# Altium schematic sheet INV.CTL.V1.SchDoc
size 1150 x 699 mm; SheetNumber: 1; SheetTotal: 1
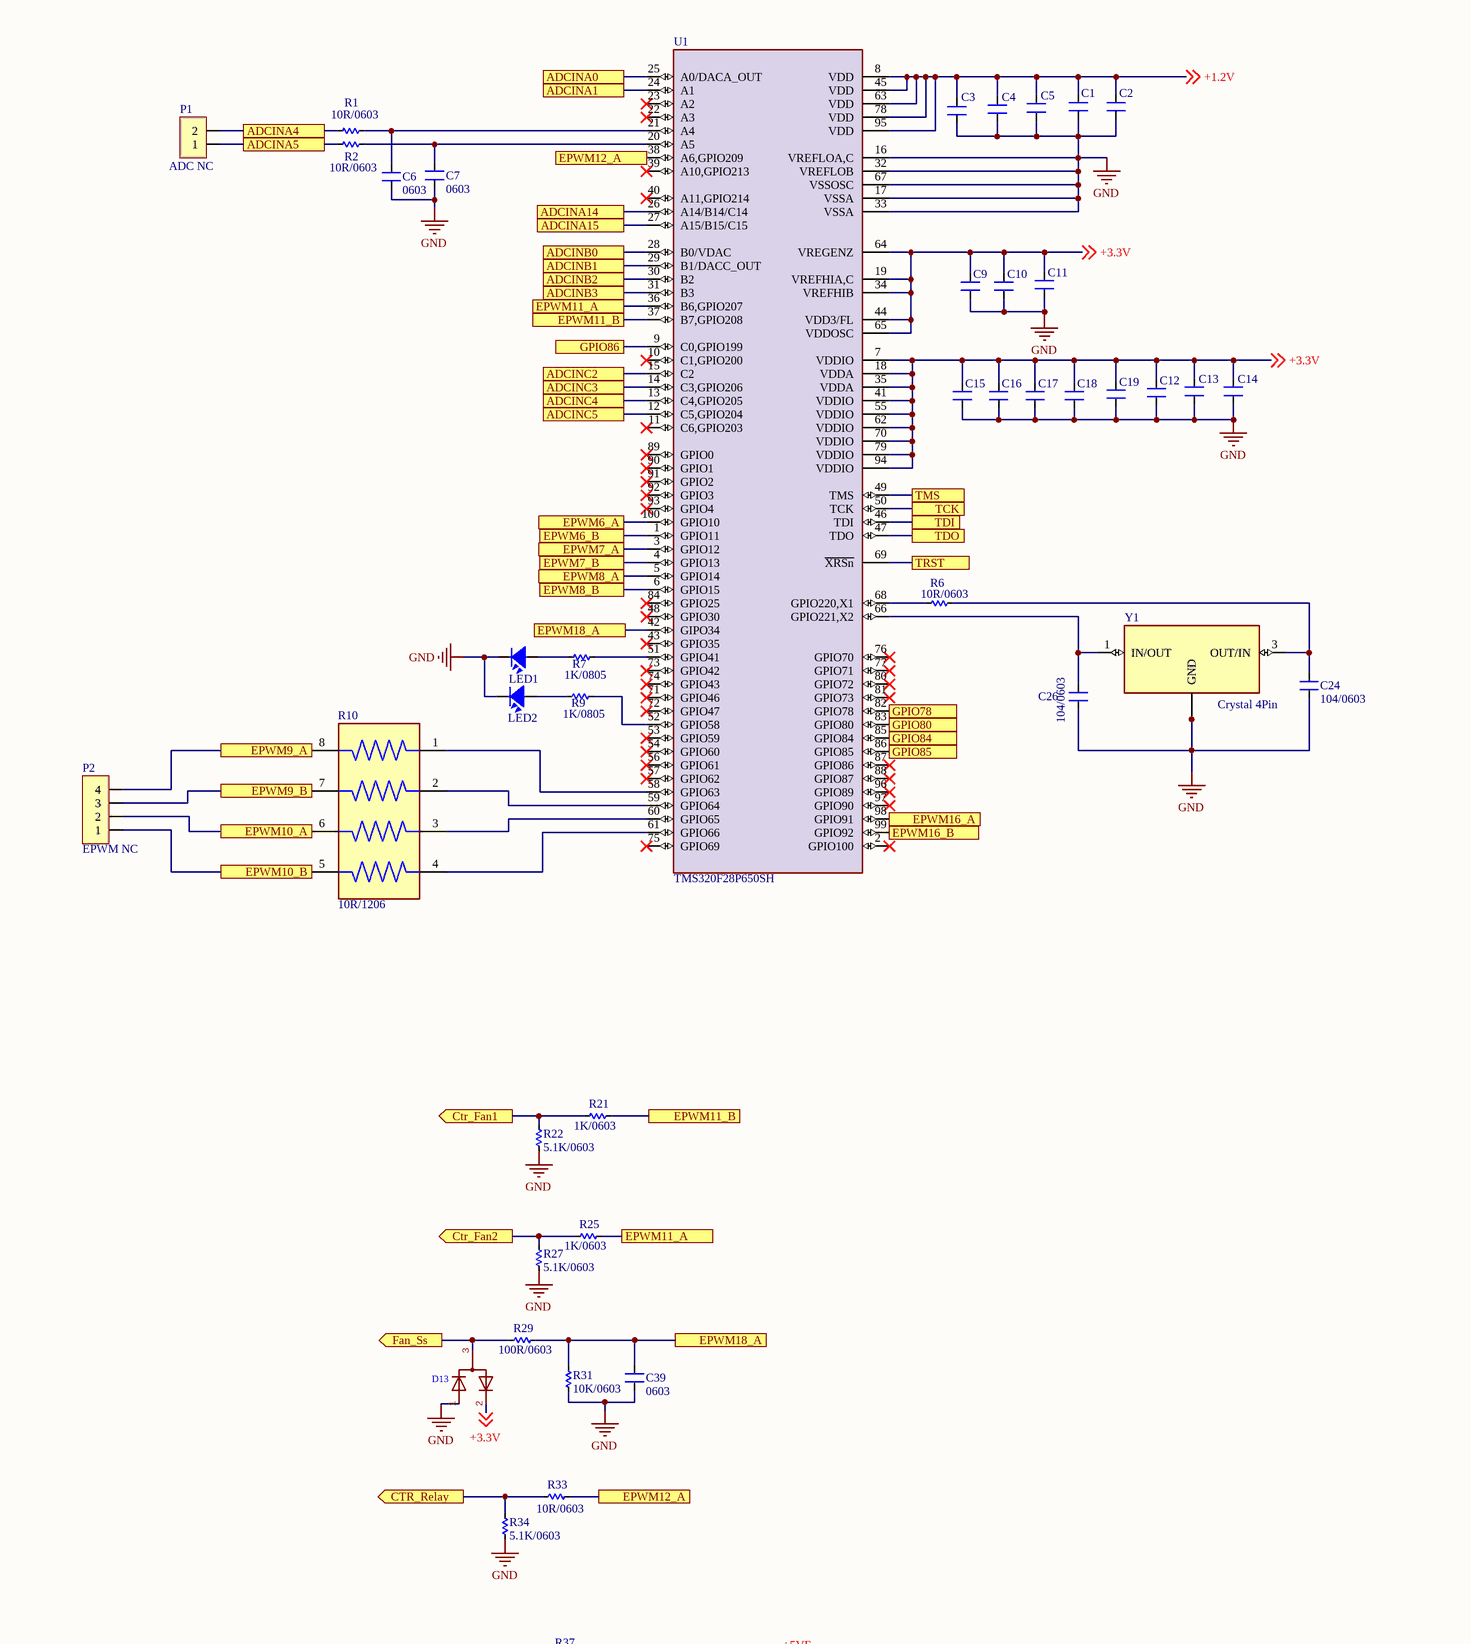
[diagram p0: INV.CTL.V1.SchDoc, top left]
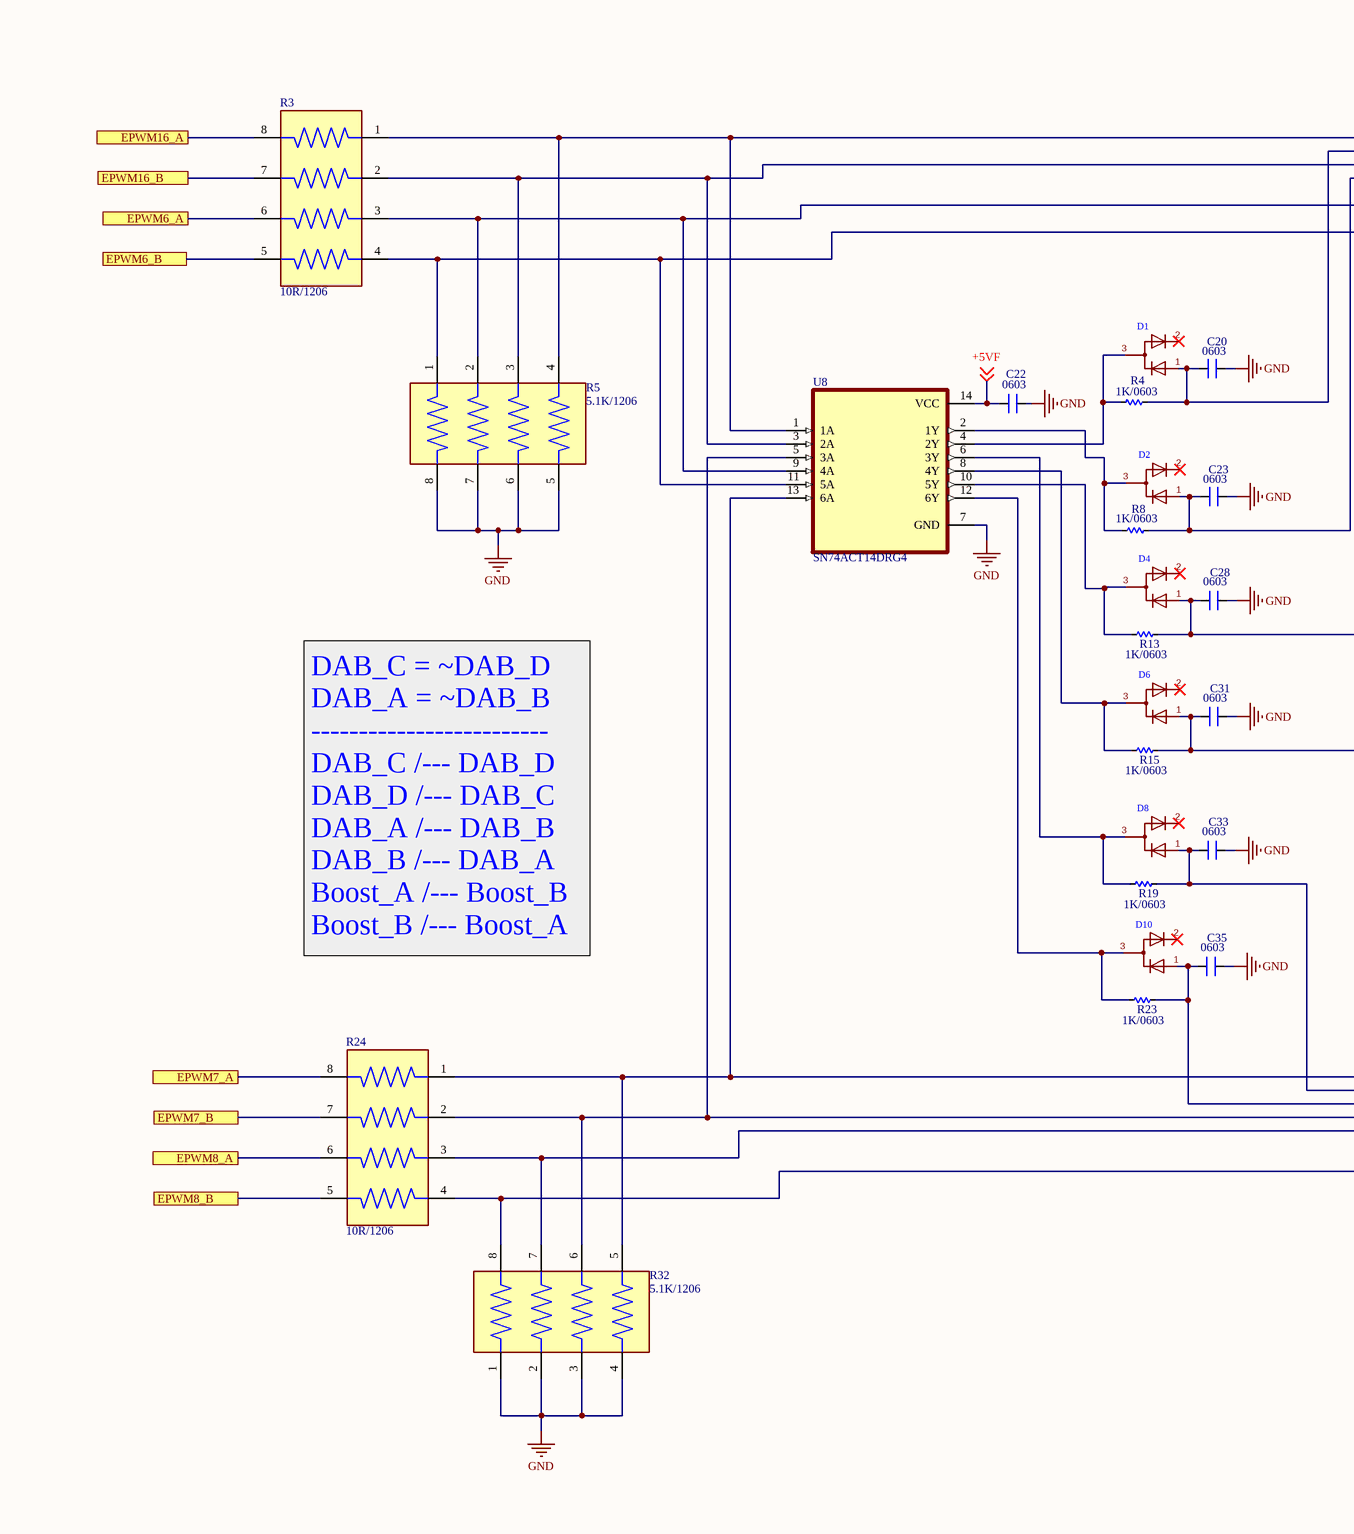
[diagram p1: INV.CTL.V1.SchDoc, top middle]
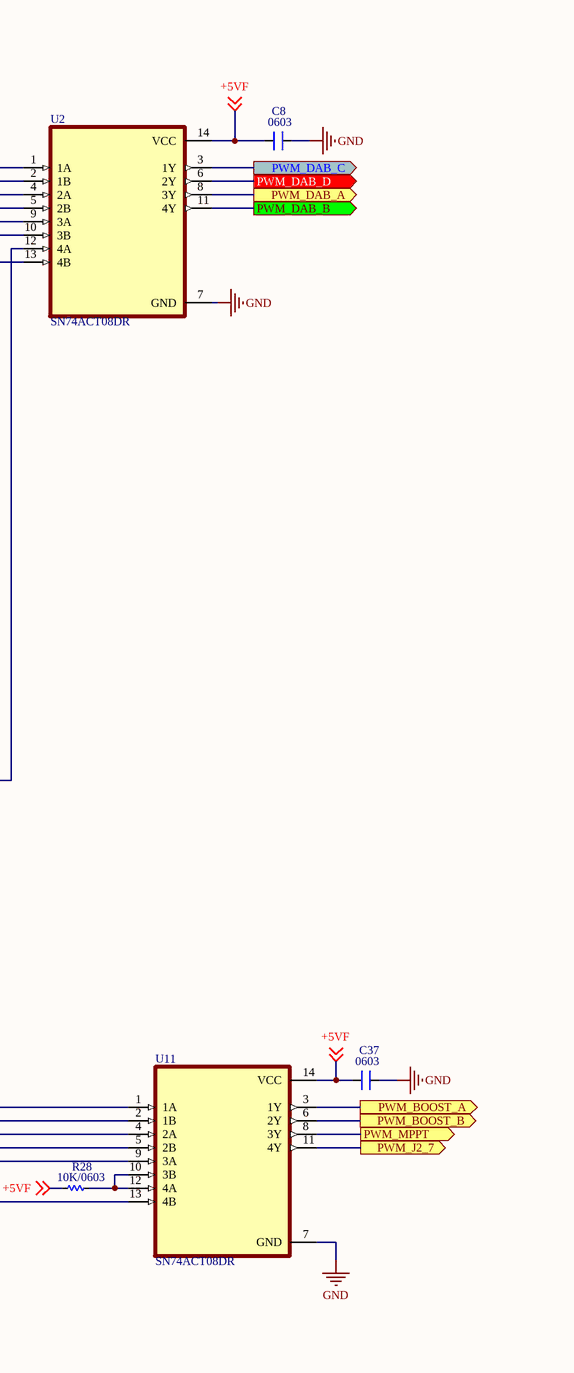
[diagram p2: INV.CTL.V1.SchDoc, top right]
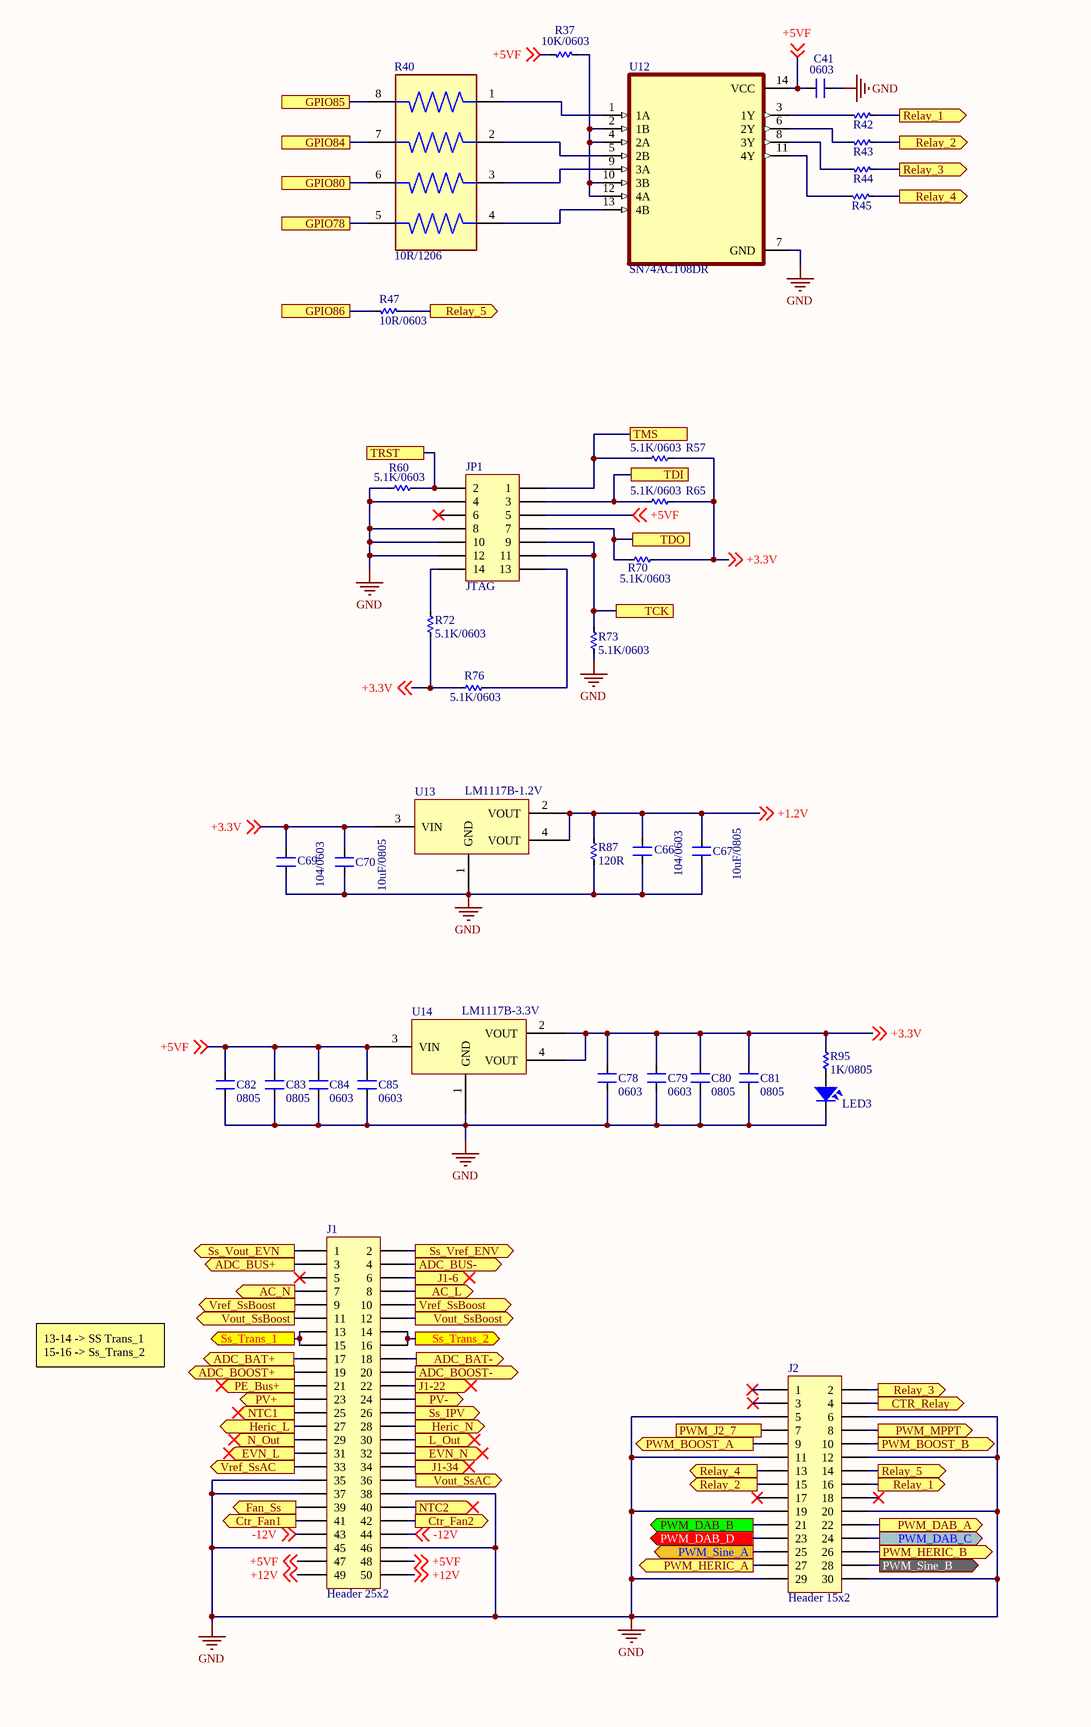
[diagram p3: INV.CTL.V1.SchDoc, bottom left]
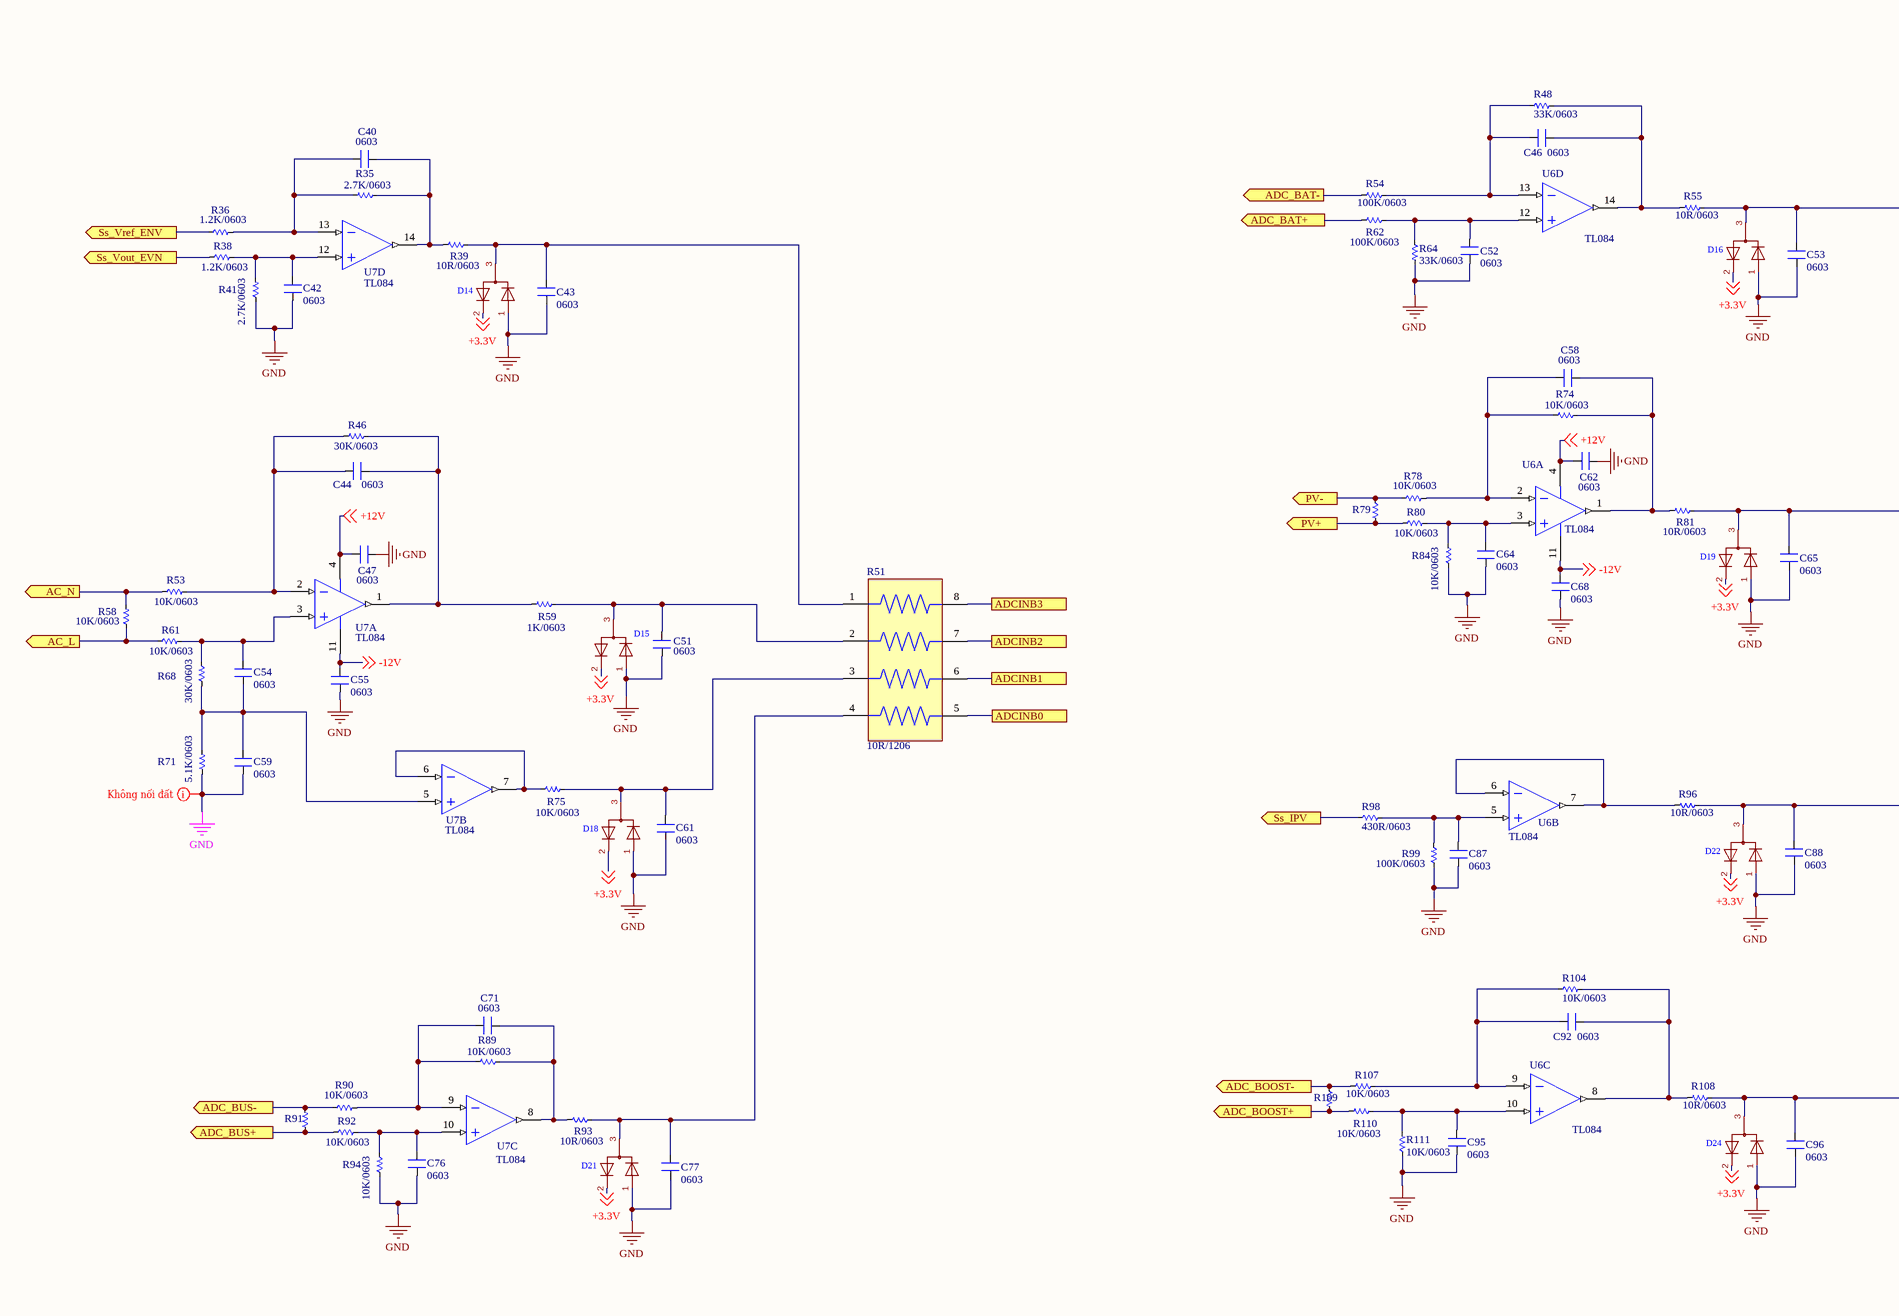
[diagram p4: INV.CTL.V1.SchDoc, bottom middle]
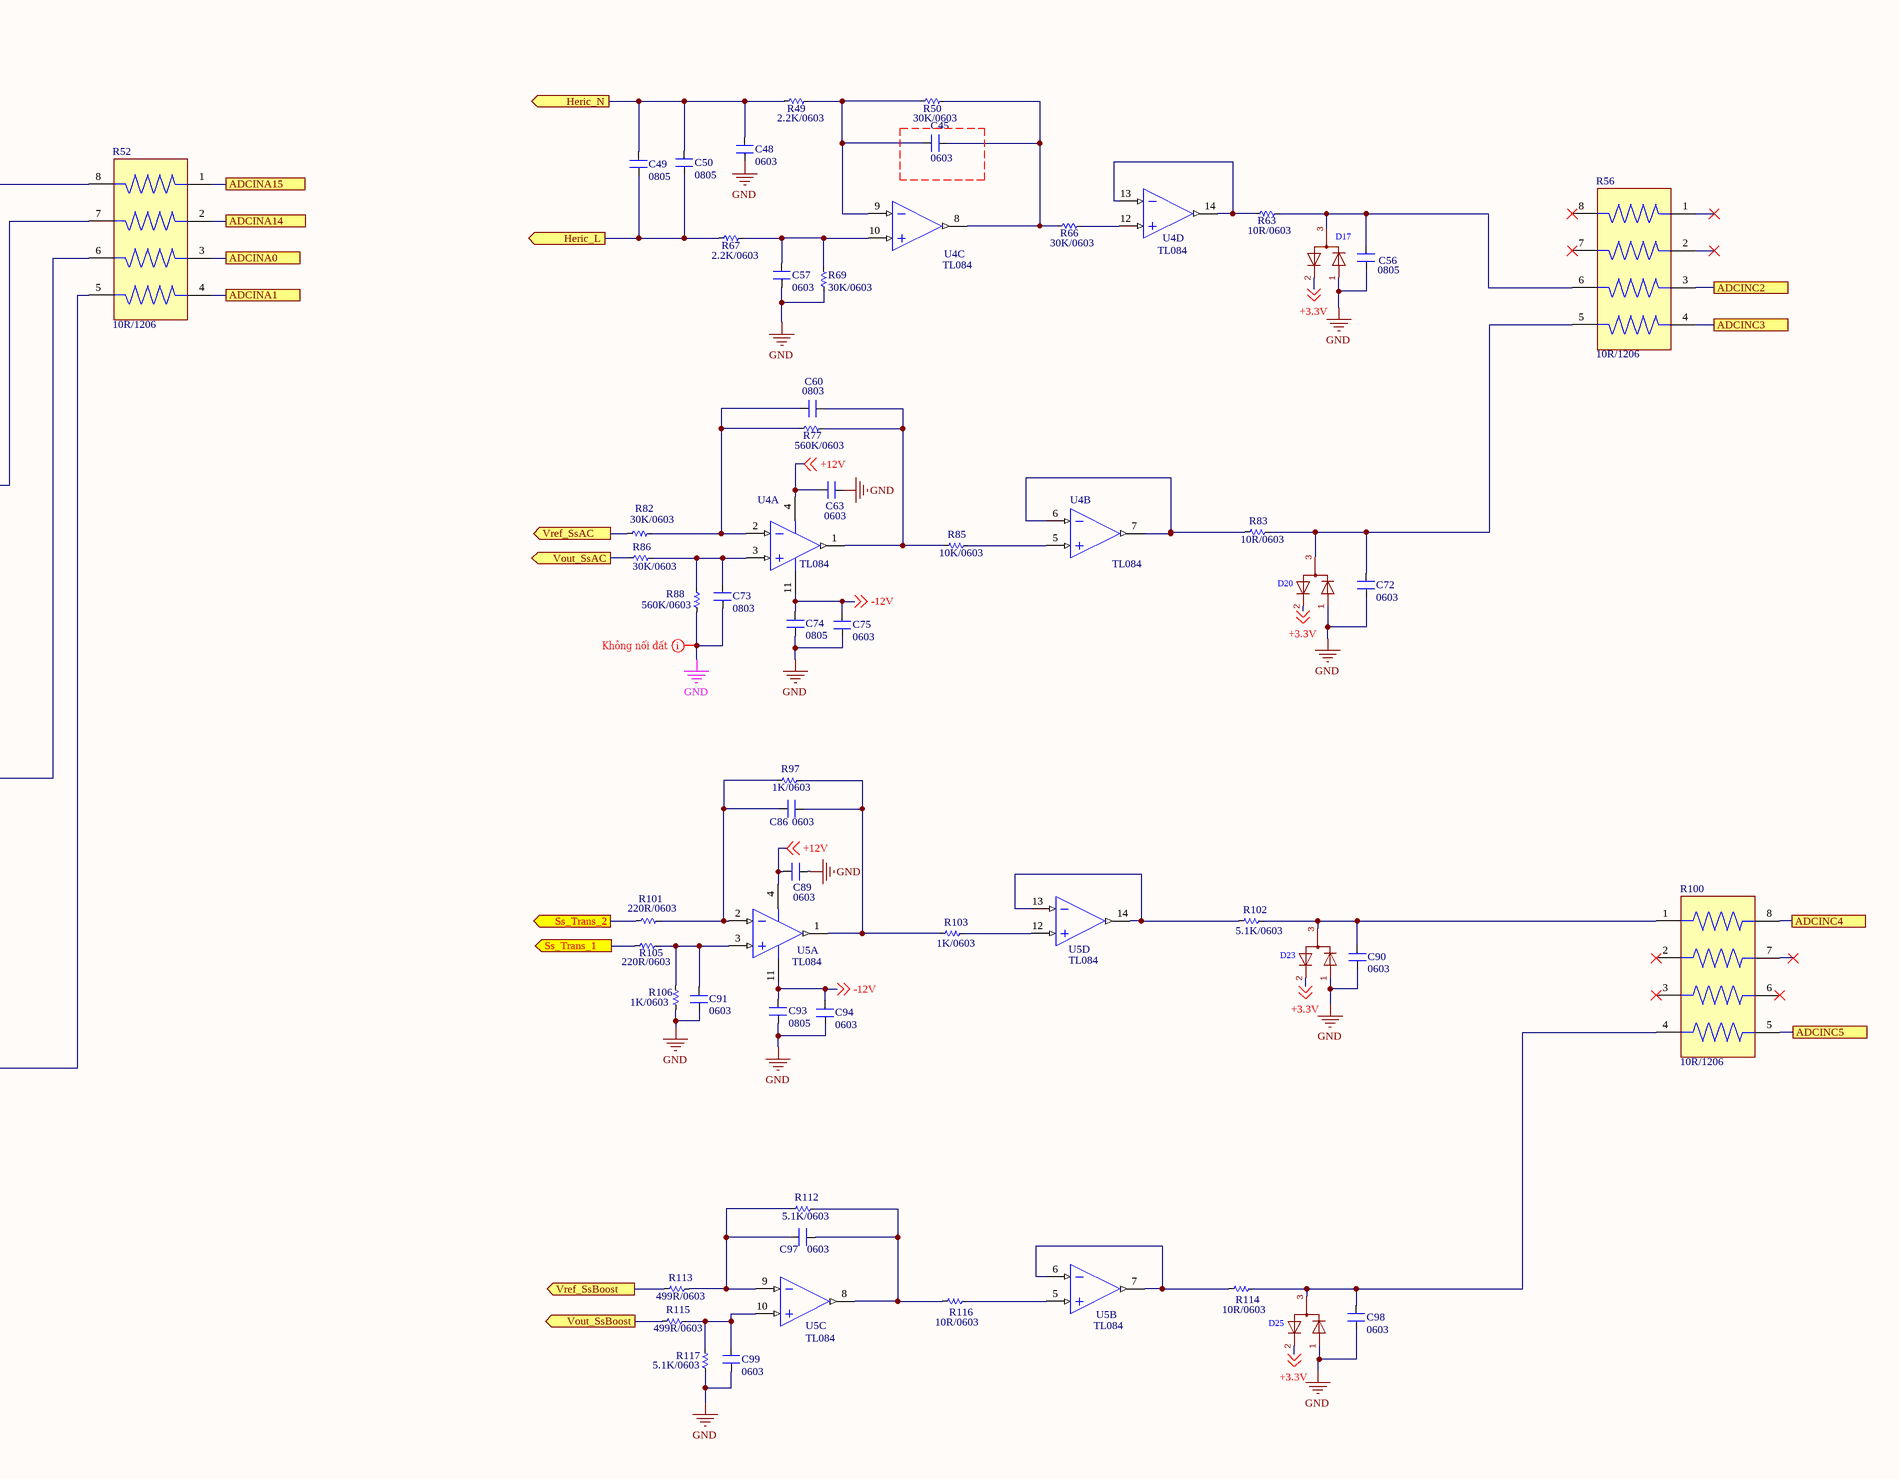
[diagram p5: INV.CTL.V1.SchDoc, bottom right]

## Parts
C1  104/0603  [CAP-SMD-0603]  (value not drawn)
C2  104/0603  [CAP-SMD-0603]  (value not drawn)
C3  104/0603  [CAP-SMD-0603]  (value not drawn)
C4  104/0603  [CAP-SMD-0603]  (value not drawn)
C5  104/0603  [CAP-SMD-0603]  (value not drawn)
C6  0603  [CAP-SMD-0603]
C7  0603  [CAP-SMD-0603]
C8  0603  [CAP-SMD-0603]
C9  104/0603  [CAP-SMD-0603]  (value not drawn)
C10  104/0603  [CAP-SMD-0603]  (value not drawn)
C11  104/0603  [CAP-SMD-0603]  (value not drawn)
C12  104/0603  [CAP-SMD-0603]  (value not drawn)
C13  104/0603  [CAP-SMD-0603]  (value not drawn)
C14  104/0603  [CAP-SMD-0603]  (value not drawn)
C15  104/0603  [CAP-SMD-0603]  (value not drawn)
C16  104/0603  [CAP-SMD-0603]  (value not drawn)
C17  104/0603  [CAP-SMD-0603]  (value not drawn)
C18  104/0603  [CAP-SMD-0603]  (value not drawn)
C19  104/0603  [CAP-SMD-0603]  (value not drawn)
C20  0603  [CAP-SMD-0603]
C22  0603  [CAP-SMD-0603]
C23  0603  [CAP-SMD-0603]
C24  104/0603  [CAP-SMD-0603]
C26  104/0603  [CAP-SMD-0603]
C28  0603  [CAP-SMD-0603]
C31  0603  [CAP-SMD-0603]
C33  0603  [CAP-SMD-0603]
C35  0603  [CAP-SMD-0603]
C37  0603  [CAP-SMD-0603]
C39  0603  [CAP-SMD-0603]
C40  0603  [CAP-SMD-0603]
C41  0603  [CAP-SMD-0603]
C42  0603  [CAP-SMD-0603]
C43  0603  [CAP-SMD-0603]
C44  0603  [CAP-SMD-0603]
C45  0603  [CAP-SMD-0603]
C46  0603  [CAP-SMD-0603]
C47  0603  [CAP-SMD-0603]
C48  0603  [CAP-SMD-0603]
C49  0805  [CAP-SMD-0805 EX]
C50  0805  [CAP-SMD-0805 EX]
C51  0603  [CAP-SMD-0603]
C52  0603  [CAP-SMD-0603]
C53  0603  [CAP-SMD-0603]
C54  0603  [CAP-SMD-0603]
C55  0603  [CAP-SMD-0603]
C56  0805  [CAP-SMD-0603]
C57  0603  [CAP-SMD-0603]
C58  0603  [CAP-SMD-0603]
C59  0603  [CAP-SMD-0603]
C60  0803  [CAP-SMD-0603]
C61  0603  [CAP-SMD-0603]
C62  0603  [CAP-SMD-0603]
C63  0603  [CAP-SMD-0603]
C64  0603  [CAP-SMD-0603]
C65  0603  [CAP-SMD-0603]
C66  104/0603  [CAP-SMD-0603]
C67  10uF/0805  [CAP-SMD-0805 EX]
C68  0603  [CAP-SMD-0603]
C69  104/0603  [CAP-SMD-0603]
C70  10uF/0805  [CAP-SMD-0805 EX]
C71  0603  [CAP-SMD-0603]
C72  0603  [CAP-SMD-0603]
C73  0803  [CAP-SMD-0603]
C74  0805  [CAP-SMD-0805 EX]
C75  0603  [CAP-SMD-0603]
C76  0603  [CAP-SMD-0603]
C77  0603  [CAP-SMD-0603]
C78  0603  [CAP-SMD-0603]
C79  0603  [CAP-SMD-0603]
C80  0805  [CAP-SMD-0805 EX]
C81  0805  [CAP-SMD-0805 EX]
C82  0805  [CAP-SMD-0805 EX]
C83  0805  [CAP-SMD-0805 EX]
C84  0603  [CAP-SMD-0603]
C85  0603  [CAP-SMD-0603]
C86  0603  [CAP-SMD-0603]
C87  0603  [CAP-SMD-0603]
C88  0603  [CAP-SMD-0603]
C89  0603  [CAP-SMD-0603]
C90  0603  [CAP-SMD-0603]
C91  0603  [CAP-SMD-0603]
C92  0603  [CAP-SMD-0603]
C93  0805  [CAP-SMD-0805 EX]
C94  0603  [CAP-SMD-0603]
C95  0603  [CAP-SMD-0603]
C96  0603  [CAP-SMD-0603]
C97  0603  [CAP-SMD-0603]
C98  0603  [CAP-SMD-0603]
C99  0603  [CAP-SMD-0603]
D1  Dual-Diode_CA_1  [SOT23-132]  (value not drawn)
D2  Dual-Diode_CA_1  [SOT23-132]  (value not drawn)
D4  Dual-Diode_CA_1  [SOT23-132]  (value not drawn)
D6  Dual-Diode_CA_1  [SOT23-132]  (value not drawn)
D8  Dual-Diode_CA_1  [SOT23-132]  (value not drawn)
D10  Dual-Diode_CA_1  [SOT23-132]  (value not drawn)
D13  Dual-Diode_CA_1  [SOT23-132]  (value not drawn)
D14  Dual-Diode_CA_1  [SOT23-132]  (value not drawn)
D15  Dual-Diode_CA_1  [SOT23-132]  (value not drawn)
D16  Dual-Diode_CA_1  [SOT23-132]  (value not drawn)
D17  Dual-Diode_CA_1  [SOT23-132]  (value not drawn)
D18  Dual-Diode_CA_1  [SOT23-132]  (value not drawn)
D19  Dual-Diode_CA_1  [SOT23-132]  (value not drawn)
D20  Dual-Diode_CA_1  [SOT23-132]  (value not drawn)
D21  Dual-Diode_CA_1  [SOT23-132]  (value not drawn)
D22  Dual-Diode_CA_1  [SOT23-132]  (value not drawn)
D23  Dual-Diode_CA_1  [SOT23-132]  (value not drawn)
D24  Dual-Diode_CA_1  [SOT23-132]  (value not drawn)
D25  Dual-Diode_CA_1  [SOT23-132]  (value not drawn)
J1  Header 25x2  [Header 2x50 V2]
J2  Header 15x2  [Header 2x15 V2]
JP1  JTAG  [Header 2x7]
LED1  LED  [LED-0805-Red]  (value not drawn)
LED2  LED  [LED-0805-Red]  (value not drawn)
LED3  LED  [LED-0805-Red]  (value not drawn)
P1  ADC NC  [JP2-C1T]
P2  EPWM NC  [JP4-C1T]
R1  10R/0603  [RES-SMD-0603]
R2  10R/0603  [RES-SMD-0603]
R3  10R/1206  [RESCAXS80P320X150X55-8N]
R4  1K/0603  [RES-SMD-0603]
R5  5.1K/1206  [RESCAXS80P320X150X55-8N]
R6  10R/0603  [RES-SMD-0603]
R7  1K/0805  [RES-SMD-0603]
R8  1K/0603  [RES-SMD-0603]
R9  1K/0805  [RES-SMD-0603]
R10  10R/1206  [RESCAXS80P320X150X55-8N]
R13  1K/0603  [RES-SMD-0603]
R15  1K/0603  [RES-SMD-0603]
R19  1K/0603  [RES-SMD-0603]
R21  1K/0603  [RES-SMD-0603]
R22  5.1K/0603  [RES-SMD-0603]
R23  1K/0603  [RES-SMD-0603]
R24  10R/1206  [RESCAXS80P320X150X55-8N]
R25  1K/0603  [RES-SMD-0603]
R27  5.1K/0603  [RES-SMD-0603]
R28  10K/0603  [RES-SMD-0603]
R29  100R/0603  [RES-SMD-0603]
R31  10K/0603  [RES-SMD-0603]
R32  5.1K/1206  [RESCAXS80P320X150X55-8N]
R33  10R/0603  [RES-SMD-0603]
R34  5.1K/0603  [RES-SMD-0603]
R35  2.7K/0603  [RES-SMD-0603]
R36  1.2K/0603  [RES-SMD-0603]
R37  10K/0603  [RES-SMD-0603]
R38  1.2K/0603  [RES-SMD-0603]
R39  10R/0603  [RES-SMD-0603]
R40  10R/1206  [RESCAXS80P320X150X55-8N]
R41  2.7K/0603  [RES-SMD-0603]
R42  10R/0603  [RES-SMD-0603]  (value not drawn)
R43  10R/0603  [RES-SMD-0603]  (value not drawn)
R44  10R/0603  [RES-SMD-0603]  (value not drawn)
R45  10R/0603  [RES-SMD-0603]  (value not drawn)
R46  30K/0603  [RES-SMD-0603]
R47  10R/0603  [RES-SMD-0603]
R48  33K/0603  [RES-SMD-0603]
R49  2.2K/0603  [RES-SMD-0603]
R50  30K/0603  [RES-SMD-0603]
R51  10R/1206  [RESCAXS80P320X150X55-8N]
R52  10R/1206  [RESCAXS80P320X150X55-8N]
R53  10K/0603  [RES-SMD-0603]
R54  100K/0603  [RES-SMD-0603]
R55  10R/0603  [RES-SMD-0603]
R56  10R/1206  [RESCAXS80P320X150X55-8N]
R57  5.1K/0603  [RES-SMD-0603]
R58  10K/0603  [RES-SMD-0603]
R59  1K/0603  [RES-SMD-0603]
R60  5.1K/0603  [RES-SMD-0603]
R61  10K/0603  [RES-SMD-0603]
R62  100K/0603  [RES-SMD-0603]
R63  10R/0603  [RES-SMD-0603]
R64  33K/0603  [RES-SMD-0603]
R65  5.1K/0603  [RES-SMD-0603]
R66  30K/0603  [RES-SMD-0603]
R67  2.2K/0603  [RES-SMD-0603]
R68  30K/0603  [RES-SMD-0603]
R69  30K/0603  [RES-SMD-0603]
R70  5.1K/0603  [RES-SMD-0603]
R71  5.1K/0603  [RES-SMD-0603]
R72  5.1K/0603  [RES-SMD-0603]
R73  5.1K/0603  [RES-SMD-0603]
R74  10K/0603  [RES-SMD-0603]
R75  10K/0603  [RES-SMD-0603]
R76  5.1K/0603  [RES-SMD-0603]
R77  560K/0603  [RES-SMD-0603]
R78  10K/0603  [RES-SMD-0603]
R79  10K/0603  [RES-SMD-0603]  (value not drawn)
R80  10K/0603  [RES-SMD-0603]
R81  10R/0603  [RES-SMD-0603]
R82  30K/0603  [RES-SMD-0603]
R83  10R/0603  [RES-SMD-0603]
R84  10K/0603  [RES-SMD-0603]
R85  10K/0603  [RES-SMD-0603]
R86  30K/0603  [RES-SMD-0603]
R87  120R  [RES-SMD-0603]
R88  560K/0603  [RES-SMD-0603]
R89  10K/0603  [RES-SMD-0603]
R90  10K/0603  [RES-SMD-0603]
R91  10K/0603  [RES-SMD-0603]  (value not drawn)
R92  10K/0603  [RES-SMD-0603]
R93  10R/0603  [RES-SMD-0603]
R94  10K/0603  [RES-SMD-0603]
R95  1K/0805  [RES-SMD-0805 EX]
R96  10R/0603  [RES-SMD-0603]
R97  1K/0603  [RES-SMD-0603]
R98  430R/0603  [RES-SMD-0603]
R99  100K/0603  [RES-SMD-0603]
R100  10R/1206  [RESCAXS80P320X150X55-8N]
R101  220R/0603  [RES-SMD-0603]
R102  5.1K/0603  [RES-SMD-0603]
R103  1K/0603  [RES-SMD-0603]
R104  10K/0603  [RES-SMD-0603]
R105  220R/0603  [RES-SMD-0603]
R106  1K/0603  [RES-SMD-0603]
R107  10K/0603  [RES-SMD-0603]
R108  10R/0603  [RES-SMD-0603]
R109  10K/0603  [RES-SMD-0603]  (value not drawn)
R110  10K/0603  [RES-SMD-0603]
R111  10K/0603  [RES-SMD-0603]
R112  5.1K/0603  [RES-SMD-0603]
R113  499R/0603  [RES-SMD-0603]
R114  10R/0603  [RES-SMD-0603]
R115  499R/0603  [RES-SMD-0603]
R116  10R/0603  [RES-SMD-0603]
R117  5.1K/0603  [RES-SMD-0603]
U1  TMS320F28P650SH  [HTQFP-100]
U2  SN74ACT08DR  [SOIC127P600X175-14N]
U4  TL084  [SO14]  (parts A,B,C,D of 4)
U5  TL084  [SO14]  (parts A,B,C,D of 4)
U6  TL084  [SO14]  (parts A,B,C,D of 4)
U7  TL084  [SO14]  (parts A,B,C,D of 4)
U8  SN74ACT14DRG4  [SOIC127P600X175-14N]
U11  SN74ACT08DR  [SOIC127P600X175-14N]
U12  SN74ACT08DR  [SOIC127P600X175-14N]
U13  LM1117B-1.2V  [SOT223]
U14  LM1117B-3.3V  [SOT223]
Y1  Crystal 4Pin  [XTAL_5032]

## Ports
AC_L (out, see INV.CTL.V1[1D]), AC_L (out, see INV.CTL.V1[2C]), AC_N (out, see INV.CTL.V1[1D]), AC_N (out, see INV.CTL.V1[2C]), ADC_BAT+ (out, see INV.CTL.V1[1D]), ADC_BAT+ (out, see INV.CTL.V1[3C]), ADC_BAT- (out, see INV.CTL.V1[1D]), ADC_BAT- (out, see INV.CTL.V1[3C]), ADC_BOOST+ (out, see INV.CTL.V1[1D]), ADC_BOOST+ (out, see INV.CTL.V1[3D]), ADC_BOOST- (out, see INV.CTL.V1[1D]), ADC_BOOST- (out, see INV.CTL.V1[3D]), ADC_BUS+ (out, see INV.CTL.V1[1D]), ADC_BUS+ (out, see INV.CTL.V1[2D]), ADC_BUS- (out, see INV.CTL.V1[1D]), ADC_BUS- (out, see INV.CTL.V1[2D]), ADCINA0 (see INV.CTL.V1[1A]), ADCINA0 (see INV.CTL.V1[4C]), ADCINA1 (see INV.CTL.V1[1A]), ADCINA1 (see INV.CTL.V1[4C]), ADCINA4, ADCINA5, ADCINA14 (see INV.CTL.V1[1A]), ADCINA14 (see INV.CTL.V1[4C]), ADCINA15 (see INV.CTL.V1[1A]), ADCINA15 (see INV.CTL.V1[4C]), ADCINB0 (see INV.CTL.V1[1A]), ADCINB0 (see INV.CTL.V1[3C]), ADCINB1 (see INV.CTL.V1[1A]), ADCINB1 (see INV.CTL.V1[3C]), ADCINB2 (see INV.CTL.V1[1A]), ADCINB2 (see INV.CTL.V1[3C]), ADCINB3 (see INV.CTL.V1[1A]), ADCINB3 (see INV.CTL.V1[3C]), ADCINC2 (see INV.CTL.V1[1A]), ADCINC2 (see INV.CTL.V1[6C]), ADCINC3 (see INV.CTL.V1[1A]), ADCINC3 (see INV.CTL.V1[6C]), ADCINC4 (see INV.CTL.V1[1A]), ADCINC4 (see INV.CTL.V1[6D]), ADCINC5 (see INV.CTL.V1[1A]), ADCINC5 (see INV.CTL.V1[6D]), Ctr_Fan1 (out, see INV.CTL.V1[1B]), Ctr_Fan1 (out, see INV.CTL.V1[1D]), Ctr_Fan2 (out, see INV.CTL.V1[1B]), Ctr_Fan2 (out, see INV.CTL.V1[1D]), CTR_Relay (out, see INV.CTL.V1[1B]), CTR_Relay (out, see INV.CTL.V1[1D]), EPWM6_A (see INV.CTL.V1[1A]), EPWM6_A (see INV.CTL.V1[4A]), EPWM6_B (see INV.CTL.V1[1A]), EPWM6_B (see INV.CTL.V1[4A]), EPWM7_A (see INV.CTL.V1[1A]), EPWM7_A (see INV.CTL.V1[5B]), EPWM7_B (see INV.CTL.V1[1A]), EPWM7_B (see INV.CTL.V1[5B]), EPWM8_A (see INV.CTL.V1[1A]), EPWM8_A (see INV.CTL.V1[5B]), EPWM8_B (see INV.CTL.V1[1A]), EPWM8_B (see INV.CTL.V1[5B]), EPWM9_A, EPWM9_B, EPWM10_A, EPWM10_B, EPWM11_A (see INV.CTL.V1[1A]), EPWM11_A (see INV.CTL.V1[1B]), EPWM11_B (see INV.CTL.V1[1A]), EPWM11_B (see INV.CTL.V1[1B]), EPWM12_A (see INV.CTL.V1[1A]), EPWM12_A (see INV.CTL.V1[1B]), EPWM16_A (see INV.CTL.V1[1B]), EPWM16_A (see INV.CTL.V1[4A]), EPWM16_B (see INV.CTL.V1[1B]), EPWM16_B (see INV.CTL.V1[4A]), EPWM18_A (see INV.CTL.V1[1A]), EPWM18_A (see INV.CTL.V1[1B]), EVN_L (out), EVN_N (out), Fan_Ss (out, see INV.CTL.V1[1B]), Fan_Ss (out, see INV.CTL.V1[1D]), GPIO78 (see INV.CTL.V1[1B]), GPIO78 (see INV.CTL.V1[1C]), GPIO80 (see INV.CTL.V1[1B]), GPIO80 (see INV.CTL.V1[1C]), GPIO84 (see INV.CTL.V1[1B]), GPIO84 (see INV.CTL.V1[1C]), GPIO85 (see INV.CTL.V1[1B]), GPIO85 (see INV.CTL.V1[1C]), GPIO86 (see INV.CTL.V1[1A]), GPIO86 (see INV.CTL.V1[1C]), Heric_L (out, see INV.CTL.V1[1D]), Heric_L (out, see INV.CTL.V1[5C]), Heric_N (out, see INV.CTL.V1[1D]), Heric_N (out, see INV.CTL.V1[5C]), J1-6 (out), J1-22 (out), J1-34 (out), L_Out (out), N_Out (out), NTC1 (out), NTC2 (out), PE_Bus+ (out), PV+ (out, see INV.CTL.V1[1D]), PV+ (out, see INV.CTL.V1[3C]), PV- (out, see INV.CTL.V1[1D]), PV- (out, see INV.CTL.V1[3C]), PWM_BOOST_A (out, see INV.CTL.V1[1D]), PWM_BOOST_A (out, see INV.CTL.V1[6B]), PWM_BOOST_B (out, see INV.CTL.V1[1D]), PWM_BOOST_B (out, see INV.CTL.V1[6B]), PWM_DAB_A (out, see INV.CTL.V1[1D]), PWM_DAB_A (out, see INV.CTL.V1[6A]), PWM_DAB_B (out, see INV.CTL.V1[1D]), PWM_DAB_B (out, see INV.CTL.V1[6A]), PWM_DAB_C (out, see INV.CTL.V1[1D]), PWM_DAB_C (out, see INV.CTL.V1[6A]), PWM_DAB_D (out, see INV.CTL.V1[1D]), PWM_DAB_D (out, see INV.CTL.V1[6A]), PWM_HERIC_A (out, see INV.CTL.V1[4B]), PWM_HERIC_B (out, see INV.CTL.V1[4A]), PWM_J2_7 (out, see INV.CTL.V1[1D]), PWM_J2_7 (out, see INV.CTL.V1[6B]), PWM_MPPT (out, see INV.CTL.V1[1D]), PWM_MPPT (out, see INV.CTL.V1[6B]), PWM_Sine_A (out, see INV.CTL.V1[4A]), PWM_Sine_B (out, see INV.CTL.V1[4B]), Relay_1 (out, see INV.CTL.V1[1C]), Relay_1 (out, see INV.CTL.V1[1D]), Relay_2 (out, see INV.CTL.V1[1C]), Relay_2 (out, see INV.CTL.V1[1D]), Relay_3 (out, see INV.CTL.V1[1C]), Relay_3 (out, see INV.CTL.V1[1D]), Relay_4 (out, see INV.CTL.V1[1C]), Relay_4 (out, see INV.CTL.V1[1D]), Relay_5 (out, see INV.CTL.V1[1C]), Relay_5 (out, see INV.CTL.V1[1D]), Ss_IPV (out, see INV.CTL.V1[1D]), Ss_IPV (out, see INV.CTL.V1[3D]), Ss_Trans_1 (out, see INV.CTL.V1[1D]), Ss_Trans_1 (out, see INV.CTL.V1[5D]), Ss_Trans_2 (out, see INV.CTL.V1[1D]), Ss_Trans_2 (out, see INV.CTL.V1[5D]), Ss_Vout_EVN (out, see INV.CTL.V1[1D]), Ss_Vout_EVN (out, see INV.CTL.V1[2C]), Ss_Vref_ENV (out, see INV.CTL.V1[1D]), Ss_Vref_ENV (out, see INV.CTL.V1[2C]), TCK (see INV.CTL.V1[1A]), TCK (see INV.CTL.V1[1C]), TDI (see INV.CTL.V1[1A]), TDI (see INV.CTL.V1[1C]), TDO (see INV.CTL.V1[1A]), TDO (see INV.CTL.V1[1C]), TMS (see INV.CTL.V1[1A]), TMS (see INV.CTL.V1[1C]), TRST (see INV.CTL.V1[1A]), TRST (see INV.CTL.V1[1C]), Vout_SsAC (out, see INV.CTL.V1[1D]), Vout_SsAC (out, see INV.CTL.V1[5C]), Vout_SsBoost (out, see INV.CTL.V1[1D]), Vout_SsBoost (out, see INV.CTL.V1[1D], INV.CTL.V1[5D]), Vref_SsAC (out, see INV.CTL.V1[1D]), Vref_SsAC (out, see INV.CTL.V1[5C]), Vref_SsBoost (out, see INV.CTL.V1[1D]), Vref_SsBoost (out, see INV.CTL.V1[1D], INV.CTL.V1[5D])

## Nets
GND: C1.1 C2.1 C3.1 C4.1 C5.1 C6.2 C7.2 C8.1 C9.1 C10.1 C11.1 C12.1 C13.1 C14.1 C15.1 C16.1 C17.1 C18.1 C19.1 C20.1 C22.1 C23.1 C24.1 C26.1 C28.1 C31.1 C33.1 C35.1 C37.1 C39.2 C41.1 C42.1 C43.2 C47.2 C48.2 C51.1 C52.2 C53.2 C55.1 C56.2 C57.2 C59.1 C61.2 C62.2 C63.2 C64.1 C65.2 C66.1 C67.1 C68.1 C69.1 C70.1 C72.2 C73.1 C74.1 C75.1 C76.1 C77.2 C78.1 C79.1 C80.1 C81.1 C82.1 C83.1 C84.1 C85.1 C87.1 C88.2 C89.2 C90.1 C91.1 C93.1 C94.1 C95.2 C96.2 C98.2 C99.2 D13.1(C) D14.1(C) D15.1(C) D16.1(C) D17.1(C) D18.1(C) D19.1(C) D20.1(C) D21.1(C) D22.1(C) D23.1(C) D24.1(C) D25.1(C) J1.35 J1.37 J1.38 J1.45 J1.46 J2.5 J2.6 J2.11 J2.12 J2.19 J2.20 J2.29 J2.30 JP1.4 JP1.8 JP1.10 JP1.12 LED1.2 LED2.2 LED3.2 R5.5 R5.6 R5.7 R5.8 R22.2 R27.2 R31.1 R32.1 R32.2 R32.3 R32.4 R34.1 R41.2 R60.1 R64.1 R69.1 R71.2 R73.2 R84.2 R87.1 R88.2 R94.2 R99.2 R106.2 R111.1 R117.2 U1.16(VREFLOA,C) U1.17(VSSA) U1.32(VREFLOB) U1.33(VSSA) U1.67(VSSOSC) U2.7(GND) U8.7(GND) U11.7(GND) U12.7(GND) U13.1(GND) U14.1(GND) Y1.2(GND) Y1.4(GND)
+1.2V: C1.2 C2.2 C3.2 C4.2 C5.2 C66.2 C67.2 R87.2 U1.8(VDD) U1.45(VDD) U1.63(VDD) U1.78(VDD) U1.95(VDD) U13.2(VOUT) U13.4(VOUT) ; off-sheet +1.2V
+3.3V: C9.2 C10.2 C11.2 C12.2 C13.2 C14.2 C15.2 C16.2 C17.2 C18.2 C19.2 C69.2 C70.2 C78.2 C79.2 C80.2 C81.2 D13.2(C) D14.2(C) D15.2(C) D16.2(C) D17.2(C) D18.2(C) D19.2(C) D20.2(C) D21.2(C) D22.2(C) D23.2(C) D24.2(C) D25.2(C) R57.2 R65.2 R70.2 R72.2 R76.2 R95.2 U1.7(VDDIO) U1.18(VDDA) U1.19(VREFHIA,C) U1.34(VREFHIB) U1.35(VDDA) U1.41(VDDIO) U1.44(VDD3/FL) U1.55(VDDIO) U1.62(VDDIO) U1.64(VREGENZ) U1.65(VDDOSC) U1.70(VDDIO) U1.79(VDDIO) U1.94(VDDIO) U13.3(VIN) U14.2(VOUT) U14.4(VOUT) ; off-sheet +3.3V
+5VF: C8.2 C22.2 C37.2 C41.2 C82.2 C83.2 C84.2 C85.2 J1.47 J1.48 JP1.5 R28.1 R37.2 U2.14(VCC) U8.14(VCC) U11.14(VCC) U12.14(VCC) U14.3(VIN) ; off-sheet +5VF
+12V: C47.1 C62.1 C63.1 C89.1 J1.49 J1.50 U4.4(VCC) U5.4(VCC) U6.4(VCC) U7.4(VCC) ; off-sheet +12V
-12V: C55.2 C68.2 C74.2 C75.2 C93.2 C94.2 J1.43 J1.44 U4.11(VEE) U5.11(VEE) U6.11(VEE) U7.11(VEE) ; off-sheet -12V
AC_L: J1.8 R58.2 R61.2 ; port AC_L
AC_N: J1.7 R53.2 R58.1 ; port AC_N
ADC_BAT+: J1.17 R62.1 ; port ADC_BAT+
ADC_BAT-: J1.18 R54.1 ; port ADC_BAT-
ADC_BOOST+: J1.19 R109.1 R110.1 ; port ADC_BOOST+
ADC_BOOST-: J1.20 R107.1 R109.2 ; port ADC_BOOST-
ADC_BUS+: J1.3 R91.2 R92.2 ; port ADC_BUS+
ADC_BUS-: J1.4 R90.2 R91.1 ; port ADC_BUS-
ADCINA0: R52.3 U1.25(A0/DACA_OUT) ; port ADCINA0
ADCINA1: R52.4 U1.24(A1) ; port ADCINA1
ADCINA4: P1.2 R1.1 ; port ADCINA4
ADCINA5: P1.1 R2.1 ; port ADCINA5
ADCINA14: R52.2 U1.26(A14/B14/C14) ; port ADCINA14
ADCINA15: R52.1 U1.27(A15/B15/C15) ; port ADCINA15
ADCINB0: R51.5 U1.28(B0/VDAC) ; port ADCINB0
ADCINB1: R51.6 U1.29(B1/DACC_OUT) ; port ADCINB1
ADCINB2: R51.7 U1.30(B2) ; port ADCINB2
ADCINB3: R51.8 U1.31(B3) ; port ADCINB3
ADCINC2: R56.3 U1.15(C2) ; port ADCINC2
ADCINC3: R56.4 U1.14(C3,GPIO206) ; port ADCINC3
ADCINC4: R100.8 U1.13(C4,GPIO205) ; port ADCINC4
ADCINC5: R100.5 U1.12(C5,GPIO204) ; port ADCINC5
Ctr_Fan1: J1.41 R21.2 R22.1 ; port Ctr_Fan1
Ctr_Fan2: J1.42 R25.2 R27.1 ; port Ctr_Fan2
CTR_Relay: J2.4 R33.1 R34.2 ; port CTR_Relay
EPWM6_A: R3.6 U1.100(GPIO10) ; port EPWM6_A
EPWM6_B: R3.5 U1.1(GPIO11) ; port EPWM6_B
EPWM7_A: R24.8 U1.3(GPIO12) ; port EPWM7_A
EPWM7_B: R24.7 U1.4(GPIO13) ; port EPWM7_B
EPWM8_A: R24.6 U1.5(GPIO14) ; port EPWM8_A
EPWM8_B: R24.5 U1.6(GPIO15) ; port EPWM8_B
EPWM9_A: P2.4 R10.8 ; port EPWM9_A
EPWM9_B: P2.3 R10.7 ; port EPWM9_B
EPWM10_A: P2.2 R10.6 ; port EPWM10_A
EPWM10_B: P2.1 R10.5 ; port EPWM10_B
EPWM11_A: R25.1 U1.36(B6,GPIO207) ; port EPWM11_A
EPWM11_B: R21.1 U1.37(B7,GPIO208) ; port EPWM11_B
EPWM12_A: R33.2 U1.38(A6,GPIO209) ; port EPWM12_A
EPWM16_A: R3.8 U1.98(GPIO91) ; port EPWM16_A
EPWM16_B: R3.7 U1.99(GPIO92) ; port EPWM16_B
EPWM18_A: C39.1 R29.1 R31.2 U1.42(GIPO34) ; port EPWM18_A
EVN_L: J1.31 ; port EVN_L
EVN_N: J1.32 ; port EVN_N
Fan_Ss: D13.3(A) J1.39 R29.2 ; port Fan_Ss
GPIO78: R40.5 U1.82(GPIO78) ; port GPIO78
GPIO80: R40.6 U1.83(GPIO80) ; port GPIO80
GPIO84: R40.7 U1.85(GPIO84) ; port GPIO84
GPIO85: R40.8 U1.86(GPIO85) ; port GPIO85
GPIO86: R47.2 U1.9(C0,GPIO199) ; port GPIO86
Heric_L: C49.2 C50.2 J1.27 R67.2 ; port Heric_L
Heric_N: C48.1 C49.1 C50.1 J1.28 R49.2 ; port Heric_N
J1-6: J1.6 ; port J1-6
J1-22: J1.22 ; port J1-22
J1-34: J1.34 ; port J1-34
L_Out: J1.30 ; port L_Out
N_Out: J1.29 ; port N_Out
NTC1: J1.25 ; port NTC1
NTC2: J1.40 ; port NTC2
PE_Bus+: J1.21 ; port PE_Bus+
PV+: J1.23 R79.2 R80.2 ; port PV+
PV-: J1.24 R78.2 R79.1 ; port PV-
PWM_BOOST_A: J2.9 U11.3(1Y) ; port PWM_BOOST_A
PWM_BOOST_B: J2.10 U11.6(2Y) ; port PWM_BOOST_B
PWM_DAB_A: J2.22 U2.8(3Y) ; port PWM_DAB_A
PWM_DAB_B: J2.21 U2.11(4Y) ; port PWM_DAB_B
PWM_DAB_C: J2.24 U2.3(1Y) ; port PWM_DAB_C
PWM_DAB_D: J2.23 U2.6(2Y) ; port PWM_DAB_D
PWM_HERIC_A: J2.27 ; port PWM_HERIC_A
PWM_HERIC_B: J2.26 ; port PWM_HERIC_B
PWM_J2_7: J2.7 U11.11(4Y) ; port PWM_J2_7
PWM_MPPT: J2.8 U11.8(3Y) ; port PWM_MPPT
PWM_Sine_A: J2.25 ; port PWM_Sine_A
PWM_Sine_B: J2.28 ; port PWM_Sine_B
Relay_1: J2.16 R42.1 ; port Relay_1
Relay_2: J2.15 R43.1 ; port Relay_2
Relay_3: J2.2 R44.1 ; port Relay_3
Relay_4: J2.13 R45.1 ; port Relay_4
Relay_5: J2.14 R47.1 ; port Relay_5
Ss_IPV: J1.26 R98.2 ; port Ss_IPV
Ss_Trans_1: J1.13 J1.15 R105.2 ; port Ss_Trans_1
Ss_Trans_2: J1.14 J1.16 R101.2 ; port Ss_Trans_2
Ss_Vout_EVN: J1.1 R38.2 ; port Ss_Vout_EVN
Ss_Vref_ENV: J1.2 R36.2 ; port Ss_Vref_ENV
TCK: JP1.9 JP1.11 R73.1 U1.50(TCK) ; port TCK
TDI: JP1.3 R65.1 U1.46(TDI) ; port TDI
TDO: JP1.7 R70.1 U1.47(TDO) ; port TDO
TMS: JP1.1 R57.1 U1.49(TMS) ; port TMS
TRST: JP1.2 R60.2 U1.69(~{XRSn}) ; port TRST
Vout_SsAC: J1.36 R86.2 ; port Vout_SsAC
Vout_SsBoost: J1.11 J1.12 R115.1 ; port Vout_SsBoost
Vref_SsAC: J1.33 R82.2 ; port Vref_SsAC
Vref_SsBoost: J1.9 J1.10 R113.1 ; port Vref_SsBoost
NetC6_1: C6.1 R1.2 U1.21(A4)
NetC7_1: C7.1 R2.2 U1.20(A5)
NetC20_2: C20.2 D1.1(C) R4.2 U2.2(1B)
NetC23_2: C23.2 D2.1(C) R8.2 U2.5(2B)
NetC24_2: C24.2 R6.1 Y1.3(OUT/IN)
NetC26_2: C26.2 U1.66(GPIO221,X2) Y1.1(IN/OUT)
NetC28_2: C28.2 D4.1(C) R13.2 U2.9(3A)
NetC31_2: C31.2 D6.1(C) R15.2 U2.12(4A)
NetC33_2: C33.2 D8.1(C) R19.2 U11.2(1B)
NetC35_2: C35.2 D10.1(C) R23.2 U11.4(2A)
NetC40_1: C40.1 R35.2 R39.1 U7.14(4_OUT)
NetC40_2: C40.2 R35.1 R36.1 U7.13(4_IN-)
NetC42_2: C42.2 R38.1 R41.1 U7.12(4_IN+)
NetC43_1: C43.1 D14.3(A) R39.2 R51.1
NetC44_1: C44.1 R46.2 R59.1 U7.1(1_OUT)
NetC44_2: C44.2 R46.1 R53.1 U7.2(1_IN-)
NetC45_1: C45.1 R49.1 R50.2 U4.9(3_IN-)
NetC45_2: C45.2 R50.1 R66.2 U4.8(3_OUT)
NetC46_1: C46.1 R48.2 R54.2 U6.13(4_IN-)
NetC46_2: C46.2 R48.1 R55.1 U6.14(4_OUT)
NetC51_2: C51.2 D15.3(A) R51.2 R59.2
NetC52_1: C52.1 R62.2 R64.2 U6.12(4_IN+)
NetC53_1: C53.1 D16.3(A) R52.8 R55.2
NetC54_1: C54.1 C59.2 R68.2 R71.1 U7.5(2_IN+)
NetC54_2: C54.2 R61.1 R68.1 U7.3(1_IN+)
NetC56_1: C56.1 D17.3(A) R56.6 R63.1
NetC57_1: C57.1 R67.1 R69.2 U4.10(3_IN+)
NetC58_1: C58.1 R74.2 R81.1 U6.1(1_OUT)
NetC58_2: C58.2 R74.1 R78.1 U6.2(1_IN-)
NetC60_1: C60.1 R77.1 R85.1 U4.1(1_OUT)
NetC60_2: C60.2 R77.2 R82.1 U4.2(1_IN-)
NetC61_1: C61.1 D18.3(A) R51.3 R75.2
NetC64_2: C64.2 R80.1 R84.1 U6.3(1_IN+)
NetC65_1: C65.1 D19.3(A) R52.7 R81.2
NetC71_1: C71.1 R89.2 R93.1 U7.8(3_OUT)
NetC71_2: C71.2 R89.1 R90.1 U7.9(3_IN-)
NetC72_1: C72.1 D20.3(A) R56.5 R83.2
NetC73_2: C73.2 R86.1 R88.1 U4.3(1_IN+)
NetC76_2: C76.2 R92.1 R94.1 U7.10(3_IN+)
NetC77_1: C77.1 D21.3(A) R51.4 R93.2
NetC86_1: C86.1 R97.2 R103.1 U5.1(1_OUT)
NetC86_2: C86.2 R97.1 R101.1 U5.2(1_IN-)
NetC87_2: C87.2 R98.1 R99.1 U6.5(2_IN+)
NetC88_1: C88.1 D22.3(A) R52.6 R96.2
NetC90_2: C90.2 D23.3(A) R100.1 R102.2
NetC91_2: C91.2 R105.1 R106.1 U5.3(1_IN+)
NetC92_1: C92.1 R104.2 R107.2 U6.9(3_IN-)
NetC92_2: C92.2 R104.1 R108.1 U6.8(3_OUT)
NetC95_1: C95.1 R110.2 R111.2 U6.10(3_IN+)
NetC96_1: C96.1 D24.3(A) R52.5 R108.2
NetC97_1: C97.1 R112.2 R116.1 U5.8(3_OUT)
NetC97_2: C97.2 R112.1 R113.2 U5.9(3_IN-)
NetC98_1: C98.1 D25.3(A) R100.4 R114.2
NetC99_1: C99.1 R115.2 R117.1 U5.10(3_IN+)
NetD1_3: D1.3(A) R4.1 U8.4(2Y)
NetD2_3: D2.3(A) R8.1 U8.2(1Y)
NetD4_3: D4.3(A) R13.1 U8.10(5Y)
NetD6_3: D6.3(A) R15.1 U8.8(4Y)
NetD8_3: D8.3(A) R19.1 U8.6(3Y)
NetD10_3: D10.3(A) R23.1 U8.12(6Y)
NetJP1_13: JP1.13 R76.1
NetJP1_14: JP1.14 R72.1
NetLED1_1: LED1.1 R7.1
NetLED2_1: LED2.1 R9.1
NetLED3_1: LED3.1 R95.1
NetR3_1: R3.1 R5.4 U2.1(1A) U8.1(1A)
NetR3_2: R3.2 R5.3 U2.4(2A) U8.3(2A)
NetR3_3: R3.3 R5.2 U2.10(3B) U8.9(4A)
NetR3_4: R3.4 R5.1 U2.13(4B) U8.11(5A)
NetR6_2: R6.2 U1.68(GPIO220,X1)
NetR7_2: R7.2 U1.51(GPIO41)
NetR9_2: R9.2 U1.52(GPIO58)
NetR10_1: R10.1 U1.58(GPIO63)
NetR10_2: R10.2 U1.59(GPIO64)
NetR10_3: R10.3 U1.60(GPIO65)
NetR10_4: R10.4 U1.61(GPIO66)
NetR24_1: R24.1 R32.5 U8.13(6A) U11.1(1A)
NetR24_2: R24.2 R32.6 U8.5(3A) U11.5(2B)
NetR24_3: R24.3 R32.7 U11.9(3A)
NetR24_4: R24.4 R32.8 U11.13(4B)
NetR28_2: R28.2 U11.10(3B) U11.12(4A)
NetR37_1: R37.1 U12.2(1B) U12.4(2A) U12.10(3B) U12.12(4A)
NetR40_1: R40.1 U12.1(1A)
NetR40_2: R40.2 U12.5(2B)
NetR40_3: R40.3 U12.9(3A)
NetR40_4: R40.4 U12.13(4B)
NetR42_2: R42.2 U12.3(1Y)
NetR43_2: R43.2 U12.6(2Y)
NetR44_2: R44.2 U12.8(3Y)
NetR45_2: R45.2 U12.11(4Y)
NetR63_2: R63.2 U4.13(4_IN-) U4.14(4_OUT)
NetR66_1: R66.1 U4.12(4_IN+)
NetR75_1: R75.1 U7.6(2_IN-) U7.7(2_OUT)
NetR83_1: R83.1 U4.6(2_IN-) U4.7(2_OUT)
NetR85_2: R85.2 U4.5(2_IN+)
NetR96_1: R96.1 U6.6(2_IN-) U6.7(2_OUT)
NetR102_1: R102.1 U5.13(4_IN-) U5.14(4_OUT)
NetR103_2: R103.2 U5.12(4_IN+)
NetR114_1: R114.1 U5.6(2_IN-) U5.7(2_OUT)
NetR116_2: R116.2 U5.5(2_IN+)

Not connected (* = marked no-connect by the designer): D1 2(C)*; D2 2(C)*; D4 2(C)*; D6 2(C)*; D8 2(C)*; D10 2(C)*; J1 5*; J2 1* 3* 17* 18*; JP1 6*; R56 1* 2* 7* 8*; R100 2* 3* 6* 7*; U1 2(GPIO100)* 10(C1,GPIO200)* 11(C6,GPIO203)* 22(A3)* 23(A2)* 39(A10,GPIO213)* 40(A11,GPIO214)* 43(GPIO35)* 48(GPIO30)* 53(GPIO59)* 54(GPIO60)* 56(GPIO61)* 57(GPIO62)* 71(GPIO46)* 72(GPIO47)* 73(GPIO42)* 74(GPIO43)* 75(GPIO69)* 76(GPIO70)* 77(GPIO71)* 80(GPIO72)* 81(GPIO73)* 84(GPIO25)* 87(GPIO86)* 88(GPIO87)* 89(GPIO0)* 90(GPIO1)* 91(GPIO2)* 92(GPIO3)* 93(GPIO4)* 96(GPIO89)* 97(GPIO90)*

## Layout directives
mark named Không nối đất: GND

## Notes on the sheet
- DAB_C = ~DAB_D DAB_A = ~DAB_B  ------------------------- DAB_C /--- DAB_D DAB_D /--- DAB_C DAB_A /--- DAB_B DAB_B /--- DAB_A Boost_A /--- Boost_B Boost_B /--- Boost_A
- 13-14 -> SS Trans_1 15-16 -> Ss_Trans_2

## Library data of the parts
C1-C20 C22-C24 C26 C28 C31 C33 C35 C37 C39-C99 = CAP-SMD: Value: 33pF
D1 D2 D4 D6 D8 D10 D13-D25 = Dual-Diode_CA_1: BAT54S(D88) thay the BAV99:A7; ki_keywords: Dual Diode Common Anode; Value: Dual_Diode_CA; Reference: D; ki_description: Dual Diode Common Anode
J1 = Header 25x2: Header, 25x2-Pin 2.5mm; LatestRevisionDate: 17-Jul-2002; LatestRevisionNote: Re-released for DXP Platform.; Publisher: Altium Limited
J2 = Header 15x2: Header, 15x2-Pin 2.5mm; LatestRevisionDate: 17-Jul-2002; LatestRevisionNote: Re-released for DXP Platform.; Publisher: Altium Limited
JP1 = Header 7x2: Header, 15x2-Pin 2.5mm; LatestRevisionDate: 17-Jul-2002; LatestRevisionNote: Re-released for DXP Platform.; Publisher: Altium Limited
LED1-LED3 = LED1-SMD: Value: LED 3 - 5 ly 2 Colour
P1 = JP2: WR-PHD 2.54 mm Angled Socket Header; Manufacturer: W¨¹rth Elektronik eiSos GmbH; partNo: 613002143121; ComponentLink1 Description: Manufacturer; ComponentLink2 Description: Datasheet; NoPins: 02; Created Date: 29 March 2013; ComponentLink1URL: http://www.we-online.com; ComponentLink2URL: http://katalog.we-online.de/em/datasheet/6130xx143121.pdf; Created by: Karrer Zheng
P2 = JP4: WR-PHD 2.54 mm Angled Socket Header; Manufacturer: W¨¹rth Elektronik eiSos GmbH; partNo: 613004143121; ComponentLink1 Description: Manufacturer; ComponentLink2 Description: Datasheet; NoPins: 04; Created Date: 29 March 2013; ComponentLink1URL: http://www.we-online.com; ComponentLink2URL: http://katalog.we-online.de/em/datasheet/6130xx143121.pdf; Created by: Karrer Zheng
R1 R2 R4 R6-R9 R13 R15 R19 R21-R23 R25 R27-R29 R31 R33-R39 R41-R50 R53-R55 R57-R99 R101-R117 = Res-SMD: Resistor; Manufacturer: Generic Components; Class: Passive; Published: 08/06/2000; Publisher: Altium Hobart Technology Centre
R3 R5 R10 R24 R32 R40 R51 R52 R56 R100 = Network Resistor: MF: {'manufacturer': u'Vishay Beyschlag'}; MP: ACASA1002S1002P1AT; Package: None; Price: None; Value: *; Availability: Unavailable
U1 = TMS320F28P650SH: Automotive C2000„ 32-bit MCU with 200 MHz, FPU, TMU, 768 KB flash, CLA, SDFM; MF: Texas Instruments; MP: TMS320F28075PZPQ; SnapEDA_Link: https://www.snapeda.com/parts/TMS320F28075PZPQ/Texas+Instruments/view-part/?ref=snap; Package: HTQFP-100 Texas Instruments; Value: *; Check_prices: https://www.snapeda.com/parts/TMS320F28075PZPQ/Texas+Instruments/view-part/?ref=eda
U2 U11 U12 = SN74ACT08DR: Quadruple 2-Input Positive-AND Gates 14-SOIC -40 to 85; MF: Texas Instruments; Mouser-Purchase-URL: https://snapeda.com/shop?store=Mouser&id=433506; Package: SOIC-14 Texas Instruments; Texas_Instruments-Purchase-URL: https://snapeda.com/shop?store=Texas+Instruments&id=433506; Digi-Key_Part_Number: 296-1066-1-ND; Value: *; SnapEDA_Link: https://www.snapeda.com/parts/SN74ACT08DR/Texas%20Instruments/view-part/433506/?ref=snap; DigiKey-Purchase-URL: https://snapeda.com/shop?store=DigiKey&id=433506; MP: SN74ACT08DR; Arrow_Electronics-Purchase-URL: https://snapeda.com/shop?store=Arrow+Electronics&id=433506; Check_prices: https://www.snapeda.com/parts/SN74ACT08DR/Texas%20Instruments/view-part/433506/?ref=eda
U4-U7 = LF347: Low Power Quad Operational Amplifier; Manufacturer Part Number: LF347BD; Manufacturer: Texas Instruments; Text Field1: pristel=Nsc\nsanopea\<parttype>.ckt; Slew Rate: 13 V/µs; Voltage - Supply, Single/Dual (±): 7 V ~ 36 V, ±3.5 V ~ 18 V; Current - Input Bias: 50pA; Voltage - Input Offset: 3000µV; Number of Circuits: 4; Gain Bandwidth Product: 3MHz; Amplifier Type: J-FET; Current - Supply: 8mA; Supplier 1: Digi-Key; Supplier Part Number 1: 296-7136-5-ND; Package / Case: 14-SOIC (3.9mm Width), 14-SOL; Supplier: Digi-Key; Current - Output / Channel: -; Packaging: Tube; RoHS: RoHS Compliant; Output Type: -; Operating Temperature: 0°C ~ 70°C; Category: Integrated Circuits (ICs); Supplier Part Number: 296-7136-5-ND
U8 = SN74ACT14DRG4: Hex Schmitt-Trigger Inverters 14-SOIC -40 to 85; MF: Texas Instruments; SnapEDA_Link: https://www.snapeda.com/parts/SN74ACT14DRG4/Texas+Instruments/view-part/?ref=snap; Package: SOIC-14 Texas Instruments; Value: *; MP: SN74ACT14DRG4; Check_prices: https://www.snapeda.com/parts/SN74ACT14DRG4/Texas+Instruments/view-part/?ref=eda
U13 U14 = AMS1117 SMD: Dán; Value: AMS1117-3.3V SOT223; Don_Vi: Con; Ma_Hang: MH000596; Ghi_Chu: *; Kieu_Chan: *; Chung_Loai: Dán
Y1 = Crystal 4Pin: The ECX-53B is a miniature SMD Crystal with a 3.2 x 5 mm footprint. This package is ideal for todays compact wireless applications where board space is critical.; MP: ECS-271.2-10-30B-RWY-TR; Package: None; Price: None; Value: *; Availability: Unavailable